# EAGLE schematic Legacy (EAGLE 8.5.2)
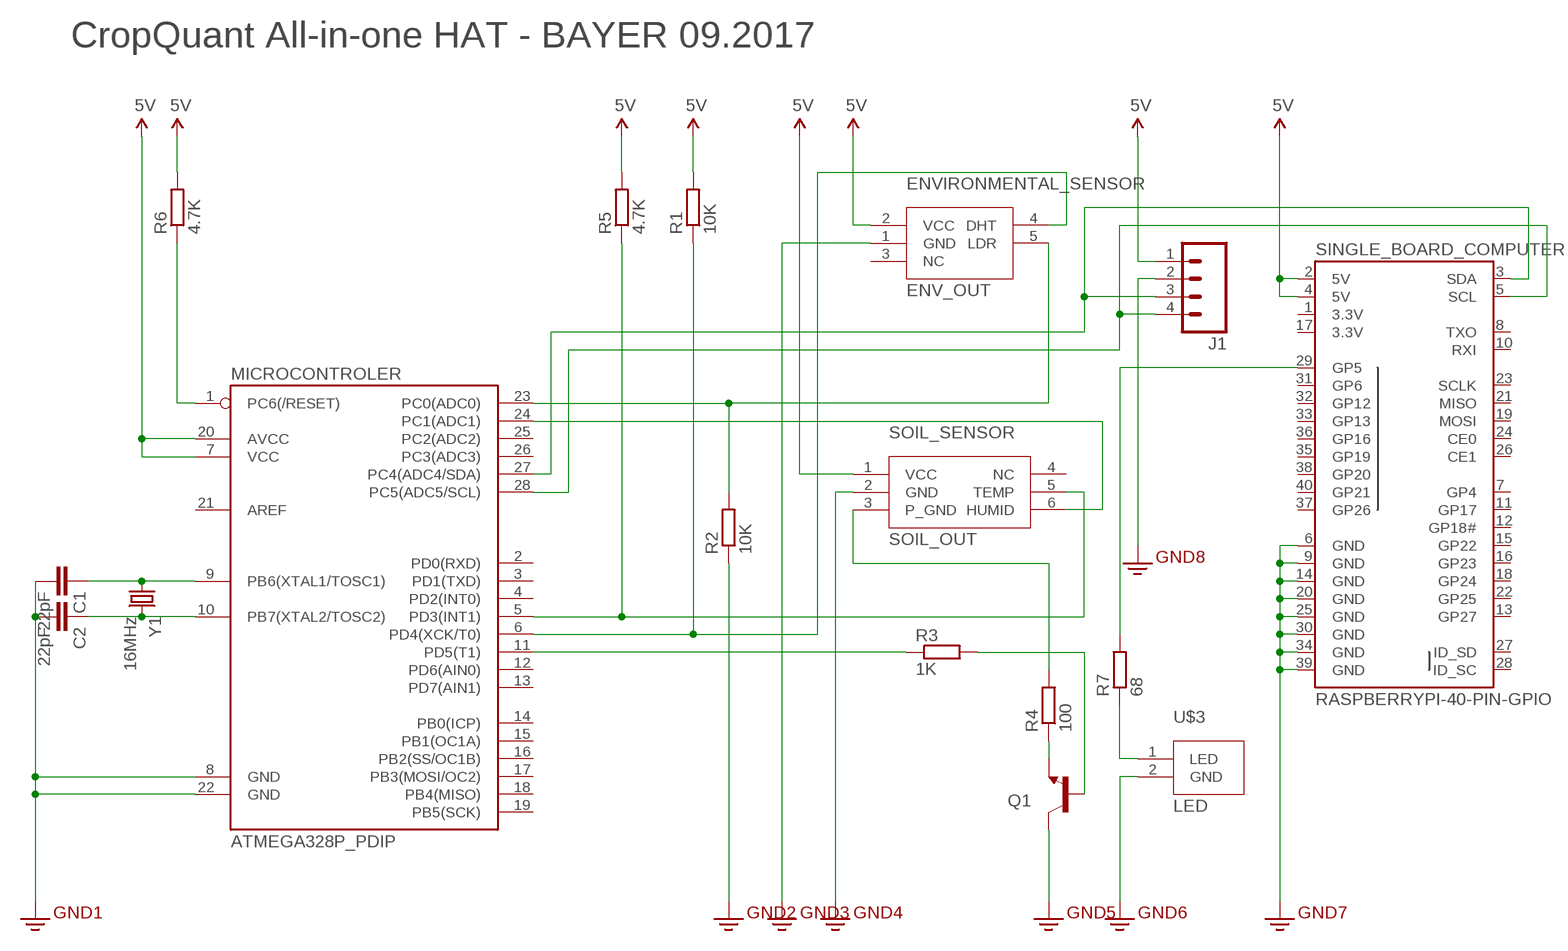
[diagram p0: schematic, sheet 1]

## Parts
C1  22pF  CAPPTH  [CAP-PTH-SMALL]
C2  22pF  CAPPTH  [CAP-PTH-SMALL]
ENVIRONMENTAL_SENSOR  ENV_OUT  [ENV_OUT]
J1  M04PTH  [1X04]
MICROCONTROLER  ATMEGA328P_PDIP  [DIL28-3]
Q1  TRANSISTOR_NPNP2N2222A  [TO-92]
R1  10K  R-EU_0204/7  [0204/7]
R2  10K  R-EU_0204/7  [0204/7]
R3  1K  R-EU_0204/7  [0204/7]
R4  100  R-EU_0204/7  [0204/7]
R5  4.7K  R-EU_0204/7  [0204/7]
R6  4.7K  R-EU_0204/7  [0204/7]
R7  68  R-EU_0204/7  [0204/7]
SINGLE_BOARD_COMPUTER  RASPBERRYPI-40-PIN-GPIO  [2X20-SHROUDED]
SOIL_SENSOR  SOIL_OUT  [SOIL_OUT]
U$3  LED  [LED]
Y1  16MHz  CRYSTALHC49US  [HC49US]

## Nets
3.3V: C1.2 C2.2 ENVIRONMENTAL_SENSOR.1(GND) J1.2 MICROCONTROLER.8(GND) MICROCONTROLER.22(GND) Q1.1(C) R2.1 SINGLE_BOARD_COMPUTER.6(GND) SINGLE_BOARD_COMPUTER.9(GND) SINGLE_BOARD_COMPUTER.14(GND) SINGLE_BOARD_COMPUTER.20(GND) SINGLE_BOARD_COMPUTER.25(GND) SINGLE_BOARD_COMPUTER.30(GND) SINGLE_BOARD_COMPUTER.34(GND) SINGLE_BOARD_COMPUTER.39(GND) SOIL_SENSOR.2(GND) U$3.2(GND) ; supply symbol labelled GND2
5V: ENVIRONMENTAL_SENSOR.2(VCC) J1.1 MICROCONTROLER.7(VCC) MICROCONTROLER.20(AVCC) R1.2 R5.2 R6.2 SINGLE_BOARD_COMPUTER.2(5V) SINGLE_BOARD_COMPUTER.4(5V) SOIL_SENSOR.1(VCC)
N$1: C1.1 MICROCONTROLER.9(PB6(XTAL1/TOSC1)) Y1.1
N$2: C2.1 MICROCONTROLER.10(PB7(XTAL2/TOSC2)) Y1.2
N$3: Q1.3(E) R4.1
N$4: ENVIRONMENTAL_SENSOR.5(LDR) MICROCONTROLER.23(PC0(ADC0)) R2.2
N$5: J1.3 MICROCONTROLER.27(PC4(ADC4/SDA)) SINGLE_BOARD_COMPUTER.3(SDA)
N$6: MICROCONTROLER.5(PD3(INT1)) R5.1 SOIL_SENSOR.5(TEMP)
N$7: ENVIRONMENTAL_SENSOR.4(DHT) MICROCONTROLER.6(PD4(XCK/T0)) R1.1
N$8: MICROCONTROLER.11(PD5(T1)) R3.1
N$9: Q1.2(B) R3.2
N$10: R4.2 SOIL_SENSOR.3(P_GND)
N$11: MICROCONTROLER.24(PC1(ADC1)) SOIL_SENSOR.6(HUMID)
N$12: J1.4 MICROCONTROLER.28(PC5(ADC5/SCL)) SINGLE_BOARD_COMPUTER.5(SCL)
N$15: MICROCONTROLER.1(PC6(/RESET)) R6.1
N$16: R7.1 U$3.1(LED)
N$17: R7.2 SINGLE_BOARD_COMPUTER.29(GP5)
Unconnected: ENVIRONMENTAL_SENSOR.3(NC) MICROCONTROLER.2(PD0(RXD)) MICROCONTROLER.3(PD1(TXD)) MICROCONTROLER.4(PD2(INT0)) MICROCONTROLER.12(PD6(AIN0)) MICROCONTROLER.13(PD7(AIN1)) MICROCONTROLER.14(PB0(ICP)) MICROCONTROLER.15(PB1(OC1A)) MICROCONTROLER.16(PB2(SS/OC1B)) MICROCONTROLER.17(PB3(MOSI/OC2)) MICROCONTROLER.18(PB4(MISO)) MICROCONTROLER.19(PB5(SCK)) MICROCONTROLER.21(AREF) MICROCONTROLER.25(PC2(ADC2)) MICROCONTROLER.26(PC3(ADC3)) SINGLE_BOARD_COMPUTER.7(GP4) SINGLE_BOARD_COMPUTER.8(TXO) SINGLE_BOARD_COMPUTER.10(RXI) SINGLE_BOARD_COMPUTER.11(GP17) SINGLE_BOARD_COMPUTER.12(GP18#) SINGLE_BOARD_COMPUTER.13(GP27) SINGLE_BOARD_COMPUTER.15(GP22) SINGLE_BOARD_COMPUTER.16(GP23) SINGLE_BOARD_COMPUTER.18(GP24) SINGLE_BOARD_COMPUTER.19(MOSI) SINGLE_BOARD_COMPUTER.21(MISO) SINGLE_BOARD_COMPUTER.22(GP25) SINGLE_BOARD_COMPUTER.23(SCLK) SINGLE_BOARD_COMPUTER.24(CE0) SINGLE_BOARD_COMPUTER.26(CE1) SINGLE_BOARD_COMPUTER.27(ID_SD) SINGLE_BOARD_COMPUTER.28(ID_SC) SINGLE_BOARD_COMPUTER.31(GP6) SINGLE_BOARD_COMPUTER.32(GP12) SINGLE_BOARD_COMPUTER.33(GP13) SINGLE_BOARD_COMPUTER.35(GP19) SINGLE_BOARD_COMPUTER.36(GP16) SINGLE_BOARD_COMPUTER.37(GP26) SINGLE_BOARD_COMPUTER.38(GP20) SINGLE_BOARD_COMPUTER.40(GP21) SOIL_SENSOR.4(NC)

## Notes on the sheet
- CropQuant All-in-one HAT - BAYER 09.2017

## Power pins joined to a net without a drawn wire
3.3V: SINGLE_BOARD_COMPUTER.1(3.3V) SINGLE_BOARD_COMPUTER.17(3.3V)

## Library data of the parts
C1 C2 = SparkFun-Capacitors:CAP: Capacitor Standard 0603 ceramic capacitor, and 0.1" leaded capacitor.
ENVIRONMENTAL_SENSOR = 000_CropQuant:ENV_OUT
J1 = 001_SparkFun-Connectors:M04: Header 4 Standard 4-pin 0.1" header. Use with straight break away headers (SKU : PRT-00116), right angle break away headers (PRT-00553), swiss pins (PRT-00743), machine pins (PRT-00117), and female headers (PRT-00115). Molex polarized connector foot print use with SKU : PRT-08231 with associated crimp pins and housings. 1MM SMD Version SKU: PRT-10208; PROD_ID: CONN-09696
MICROCONTROLER = SparkFun-DigitalIC:ATMEGA328P_PDIP: uC used in the Arduino 32kb flash, 1k EEPROM, 2k SRAM This is the through-hole version of this chip.
Q1 = SparkFun-DiscreteSemi:TRANSISTOR_NPN: Generic NPN BJT MMBT2222A - TRANS-08049 (SOT-23, 1A 40V) MPSA42 - TRANS-09116 (SOT-23, 500mA 300V) MMBT5088LT1G - TRANS-11160 (SOT-23, 50 mA 30V) BC547 - COM-08928 <http://www.sparkfun.com/products/8928> (TO-92 45V 100mA) (1.Collector 2.Base 3.Emitter) 2N3904 - COM-00521 <http://www.sparkfun.com/products/521> (TO-92 40V 200mA) (1.Emitter 2.Base 3.Collector) P2N2222A - COM-12852 <http://www.sparkfun.com/products/12852> (TO-92 40V 600mA) (1.Collector 2.Base 3.Emitter); PROD_ID: TRANS-09536
R1-R7 = resistor:R-EU_: RESISTOR, European symbol
SINGLE_BOARD_COMPUTER = 001_SparkFun-Boards:RASPBERRYPI-40-PIN-GPIO: Second Generation Raspberry Pi GPIO Header 2x20 pin connector, as found on B, B+, A+ models.
SOIL_SENSOR = 000_CropQuant:SOIL_OUT
U$3 = 000_CropQuant:LED
Y1 = SparkFun-FreqCtrl:CRYSTAL: Various standard crystals. Proven footprints.